# Altium project JacdacPowerUsbMicro2Port 137.PrjPCB
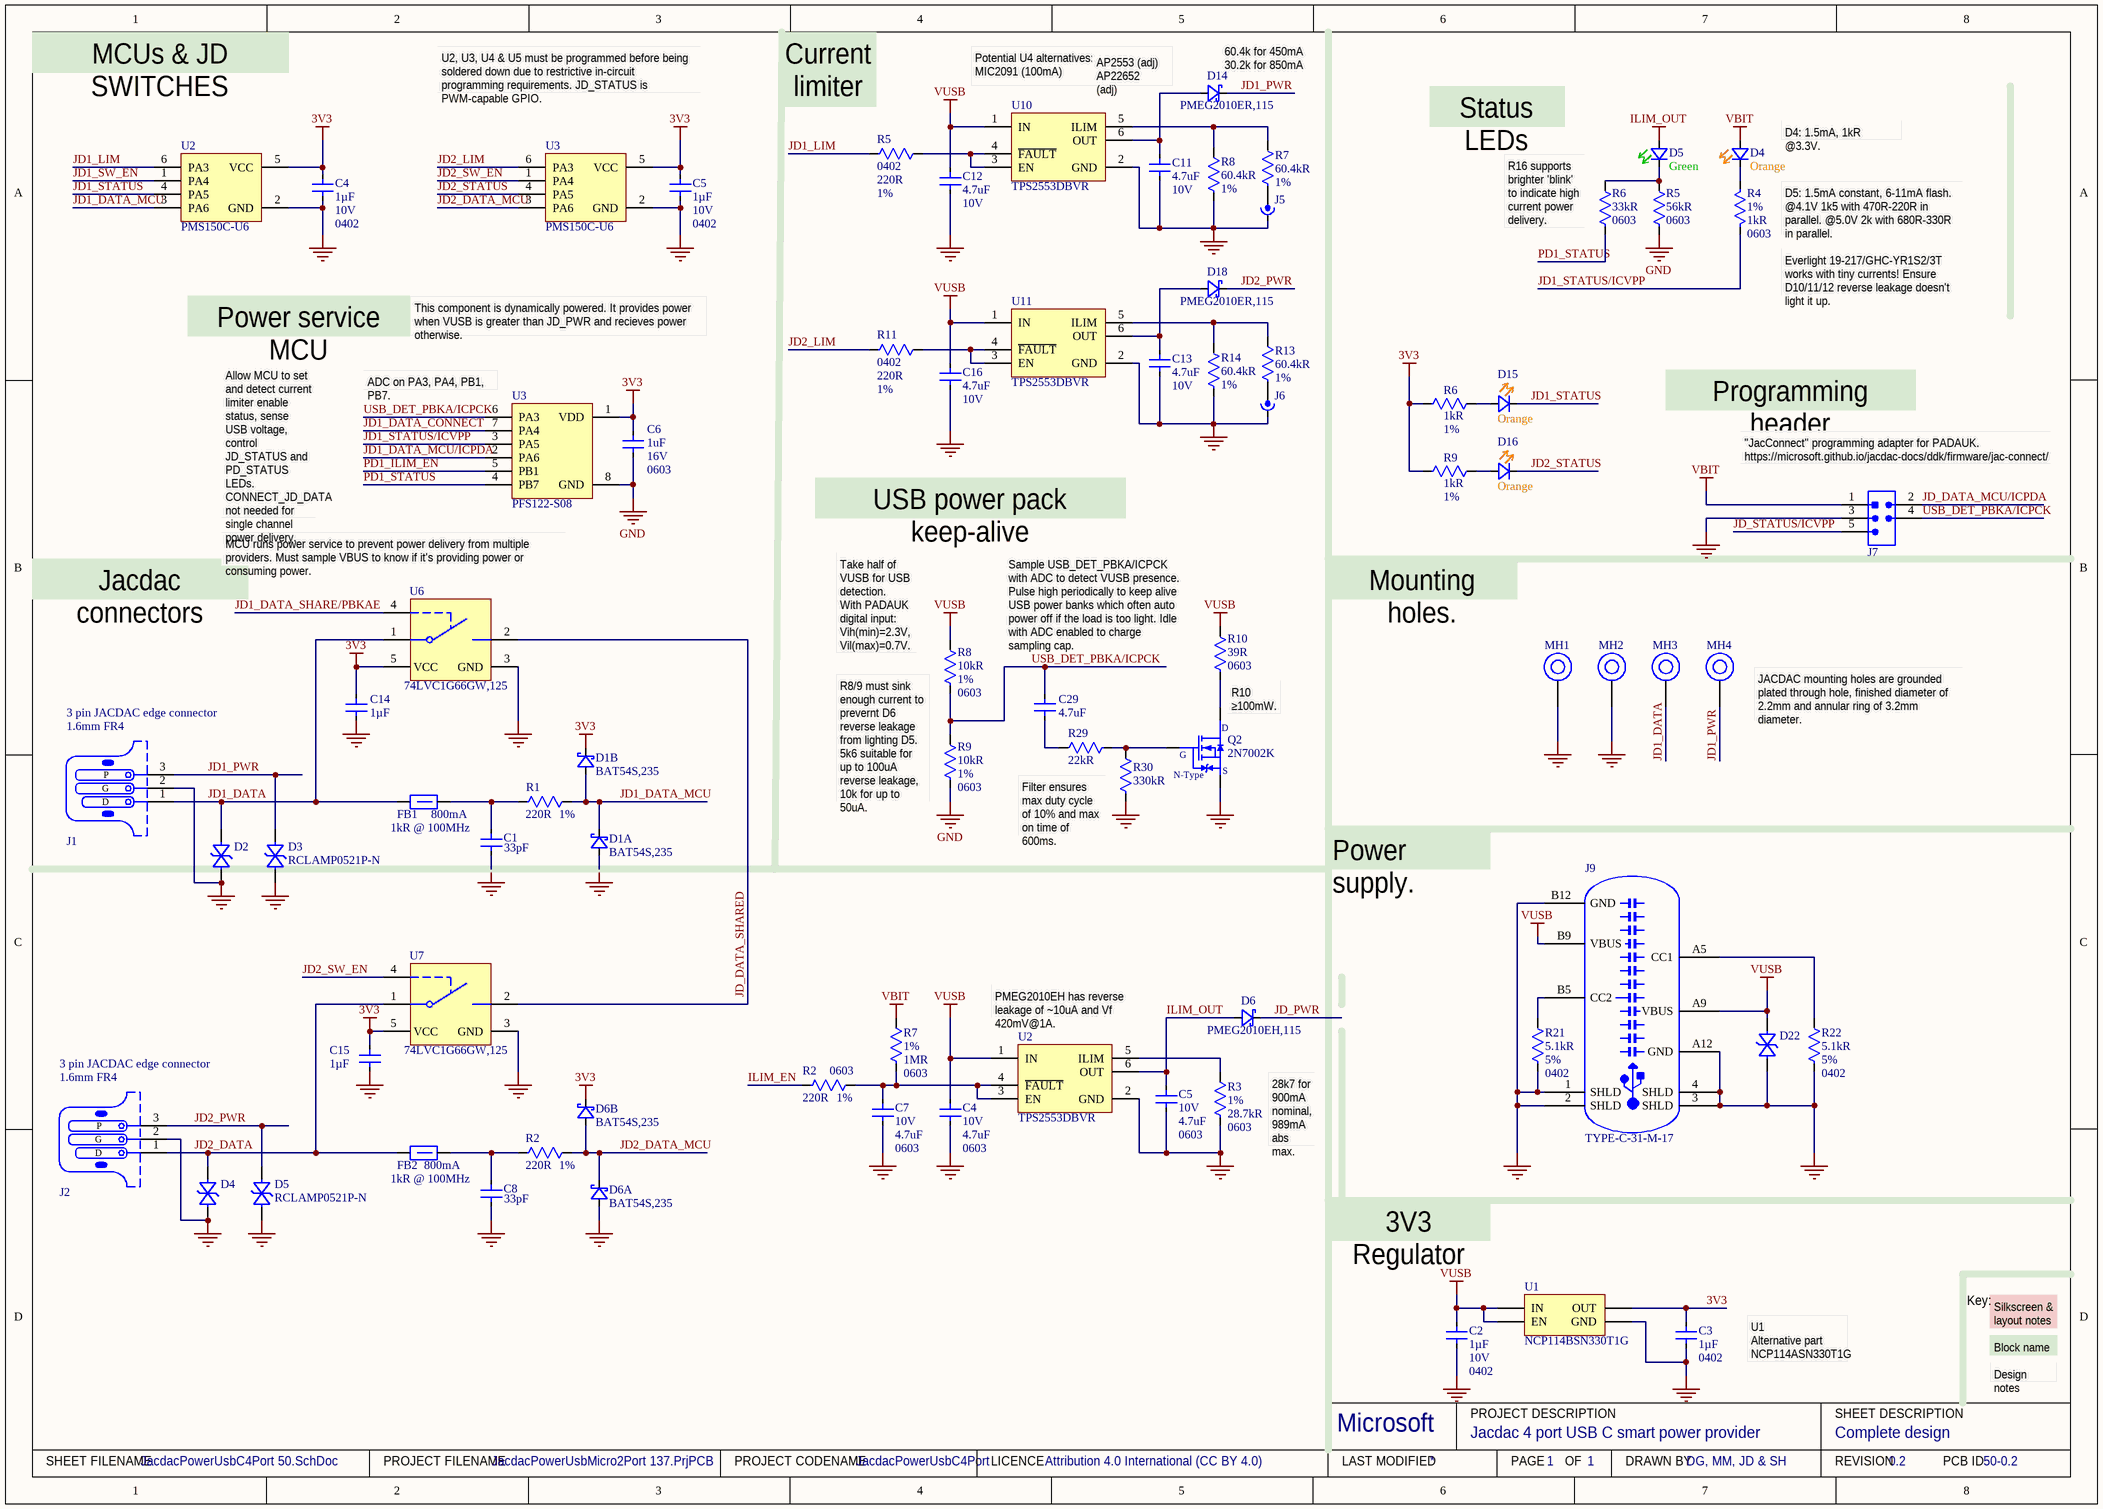
[diagram p0: JacdacPowerUsbC4Port 50.SchDoc]
ProjectCodeName: JacdacPowerUsbC4Port; ProjectCodenameDescription: Jacdac 4 port USB C smart power provider; ProjectCodenameID: 50; ProjectDrawnBy: DG, MM, JD & SH; ProjectLicenceTerms: Attribution 4.0 International (CC BY 4.0); ProjectRevision: 0.2
1 sheet, 76 parts. Net scope: global (net labels, ports and power ports of the same name join across sheets).
Board files: JacdacPowerUsbC4Port 50.PcbDoc, Panelized JacdacPowerUsbC4Port 50.PcbDoc

## Sheet JacdacPowerUsbC4Port 50.SchDoc: Complete design
size A3; DrawnBy: DG, MM, JD & SH; DocumentNumber: 1; Revision: 0.2; SheetNumber: 1; SheetTotal: 1; VersionControl_RevNumber: 1

### Parts
(Parts that share a designator on the sheet are numbered #1, #2 ... from top to bottom, then left to right.)
C1  Capacitance: 33pF  [C0402_0.55MM - without outline]  (hidden comment: CL05C330JB5NNNC)
C2  Capacitance: 1µF  Voltage Rating: 10V  Case Code (Imperial): 0402  [C0402_0.55MM - without outline]  (hidden comment: CL05A105KP5NNNC)
C3  Capacitance: 1µF  Case Code (Imperial): 0402  [C0402_0.55MM - without outline]  (hidden comment: CL05A105KP5NNNC)
C4#1  Capacitance: 1µF  Voltage Rating: 10V  Case Code (Imperial): 0402  [C0402_0.55MM - without outline]  (hidden comment: CL05A105KP5NNNC)
C4#2  Voltage Rating: 10V  Capacitance: 4.7uF  Case Code (Imperial): 0603  [C0603 - without outline]  (hidden comment: CL10A475KP8NNNC)
C5#1  Capacitance: 1µF  Voltage Rating: 10V  Case Code (Imperial): 0402  [C0402_0.55MM - without outline]  (hidden comment: CL05A105KP5NNNC)
C5#2  Voltage Rating: 10V  Capacitance: 4.7uF  Case Code (Imperial): 0603  [C0603 - without outline]  (hidden comment: CL10A475KP8NNNC)
C6  Voltage: 16V  Case/Package: 0603  Capacitance: 1uF  [C0603 - without outline]  (hidden comment: 1uF 16V)
C7  Voltage Rating: 10V  Capacitance: 4.7uF  Case Code (Imperial): 0603  [C0603 - without outline]  (hidden comment: CL10A475KP8NNNC)
C8  Capacitance: 33pF  [C0402_0.55MM - without outline]  (hidden comment: CL05C330JB5NNNC)
C11  Capacitance: 4.7uF  Voltage Rating: 10V  [R0402 - Without outline]  (hidden comment: CL05A475MP5NRNC)
C12  Capacitance: 4.7uF  Voltage Rating: 10V  [R0402 - Without outline]  (hidden comment: CL05A475MP5NRNC)
C13  Capacitance: 4.7uF  Voltage Rating: 10V  [R0402 - Without outline]  (hidden comment: CL05A475MP5NRNC)
C14  Capacitance: 1µF  [C0402_0.55MM - without outline]  (hidden comment: CL05A105KP5NNNC)
C15  Capacitance: 1µF  [C0402_0.55MM - without outline]  (hidden comment: CL05A105KP5NNNC)
C16  Capacitance: 4.7uF  Voltage Rating: 10V  [R0402 - Without outline]  (hidden comment: CL05A475MP5NRNC)
C29  Capacitance: 4.7uF  [C0402_0.55mm - without outline]  (hidden comment: CL05A475MP5NRNC)
D1  Manufacturer Part Number: BAT54S,235  [NXP-BAT54S-TO-236AB - without outline]  (hidden comment: BAT54S)  (parts A,B of 2)
D2  RCLAMP0521P-N  [TVS 0402 - without outline]  (value not drawn)
D3  RCLAMP0521P-N  [TVS 0402 - without outline]
D4#1  Colour: Orange  [0603 Orange]  (hidden comment: 19-217/S2C-AQ1R1B/3T)
D4#2  RCLAMP0521P-N  [TVS 0402 - without outline]  (value not drawn)
D5#1  Colour: Green  [0603 Green]
D5#2  RCLAMP0521P-N  [TVS 0402 - without outline]
D6#1  PMEG2010EH,115  [SOD-123W]
D6#2  Manufacturer Part Number: BAT54S,235  [NXP-BAT54S-TO-236AB - without outline]  (hidden comment: BAT54S)  (parts A,B of 2)
D14  PMEG2010ER,115  [SOD-123W]
D15  Colour: Orange  [0603 Orange]  (hidden comment: 19-217/S2C-AQ1R1B/3T)
D16  Colour: Orange  [0603 Orange]  (hidden comment: 19-217/S2C-AQ1R1B/3T)
D18  PMEG2010ER,115  [SOD-123W]
D22  RCLAMP0521P-N  [TVS 0402 - without outline]  (value not drawn)
FB1  Current Rating: 800mA  Impedance: 1kR @ 100MHz  [TDK MPZ1608 0.8mm - without outline]  (hidden comment: TDK MPZ1608S102ATA00)
FB2  Current Rating: 800mA  Impedance: 1kR @ 100MHz  [TDK MPZ1608 0.8mm - without outline]  (hidden comment: TDK MPZ1608S102ATA00)
J1  3 pin JACDAC edge connector  PCB Type: 1.6mm FR4  [JACDAC_EDGE_CONNECTOR_0.15mm_T&G]  (no BOM)
J2  3 pin JACDAC edge connector  PCB Type: 1.6mm FR4  [JACDAC_EDGE_CONNECTOR_0.15mm_T&G]  (no BOM)
J5  OpenSolderBlob  [SolderBlobA]  (value not drawn)  (no BOM)
J6  OpenSolderBlob  [SolderBlobA]  (value not drawn)  (no BOM)
J7  Hack Connect Mini 1.27 mm pitch 2-row  [HACK_CONNECT_MINI_5_X_1_27_0.559mm_TH]  (value not drawn)  (no BOM)
J9  TYPE-C-31-M-17  [TYPE-C-31-M-17]
MH1  MH_5.0MMK_3.0MMC_2.1MMD_PTH  [MH_5.0MMK_3.0MMC_2.1MMD_PTH]  (value not drawn)  (no BOM)
MH2  MH_5.0MMK_3.0MMC_2.1MMD_PTH  [MH_5.0MMK_3.0MMC_2.1MMD_PTH]  (value not drawn)  (no BOM)
MH3  MH_5.0MMK_3.0MMC_2.1MMD_PTH  [MH_5.0MMK_3.0MMC_2.1MMD_PTH]  (value not drawn)  (no BOM)
MH4  MH_5.0MMK_3.0MMC_2.1MMD_PTH  [MH_5.0MMK_3.0MMC_2.1MMD_PTH]  (value not drawn)  (no BOM)
Q2  2N7002K  [SOT23-ONS]
R1  Resistance: 220R  Tolerance: 1%  [R0402 - Without outline]  (hidden comment: RC0402FR-07220RL)
R2#1  Tolerance: 1%  Case/Package: 0603  [RC0603]  (hidden comment: 220R)
R2#2  Resistance: 220R  Tolerance: 1%  [R0402 - Without outline]  (hidden comment: RC0402FR-07220RL)
R3  Tolerance: 1%  Resistance: 28.7kR  Case/Package: 0603  [RC0603]  (hidden comment: 28.7k)
R4  Tolerance: 1%  Resistance: 1kR  Case/Package: 0603  [RC0603]  (hidden comment: 1k)
R5#1  Case Code (Imperial): 0402  Resistance: 220R  Tolerance: 1%  [R0402 - Without outline]  (hidden comment: RC0402FR-07220RL)
R5#2  value 56kR  Package Size: 0603  [CC0603]  (hidden comment: RES0603_GENERIC)
R6#1  value 33kR  Package Size: 0603  [CC0603]  (hidden comment: RES0603_GENERIC)
R6#2  Tolerance: 1%  Resistance: 1kR  [R0402 - Without outline]  (hidden comment: RC0402FR-071KL)
R7#1  Resistance: 60.4kR  Tolerance: 1%  [R0402 - Without outline]  (hidden comment: RC0402FR-0760K4L)
R7#2  Tolerance: 1%  Resistance: 1MR  Case/Package: 0603  [RC0603-M]  (hidden comment: 1M)
R8#1  Resistance: 60.4kR  Tolerance: 1%  [R0402 - Without outline]  (hidden comment: RC0402FR-0760K4L)
R8#2  value 10kR  Package Size: 0603  Tolerance: 1%  [CC0603]  (hidden comment: RES0603_GENERIC)
R9#1  Tolerance: 1%  Resistance: 1kR  [R0402 - Without outline]  (hidden comment: RC0402FR-071KL)
R9#2  value 10kR  Package Size: 0603  Tolerance: 1%  [CC0603]  (hidden comment: RES0603_GENERIC)
R10  Resistance: 39R  Case Code (Imperial): 0603  [RC0603-M]  (hidden comment: RC0603FR-0739RL)
R11  Case Code (Imperial): 0402  Resistance: 220R  Tolerance: 1%  [R0402 - Without outline]  (hidden comment: RC0402FR-07220RL)
R13  Resistance: 60.4kR  Tolerance: 1%  [R0402 - Without outline]  (hidden comment: RC0402FR-0760K4L)
R14  Resistance: 60.4kR  Tolerance: 1%  [R0402 - Without outline]  (hidden comment: RC0402FR-0760K4L)
R21  Resistance: 5.1kR  Tolerance: 5%  Case Code (Imperial): 0402  [R0402 - Without outline]  (hidden comment: RC0402JR-075K1L)
R22  Resistance: 5.1kR  Tolerance: 5%  Case Code (Imperial): 0402  [R0402 - Without outline]  (hidden comment: RC0402JR-075K1L)
R29  Resistance: 22kR  [R0402 - Without outline]  (hidden comment: RC0402FR-0722KL)
R30  Resistance: 330kR  [R0402 - without outline]  (hidden comment: RC0402FR-07330KL)
U1  LDO 3.3V/300 mA  [ON_SEMI-SOT23-5 - without outline]  (value not drawn)
U2#1  Manufacturer Part Number: PMS150C-U6  [SOT23-6]  (hidden comment: PMS150C)
U2#2  TPS2553DBVR  [TI-TPS2553 - without_outline]
U3#1  Manufacturer Part Number: PMS150C-U6  [SOT23-6]  (hidden comment: PMS150C)
U3#2  PFS122-S08  [SOP-8]
U6  74LVC1G66GW,125  [TSSOP-5/SOT353-1]
U7  74LVC1G66GW,125  [TSSOP-5/SOT353-1]
U10  TPS2553DBVR  [TI-TPS2553]
U11  TPS2553DBVR  [TI-TPS2553]

### Nets
3V3: C3.2 C4#1.2 C5#1.2 C6.2 C14.2 C15.2 D1.2(K) D6#2.2(K) R6#2.2 R9#1.2 U1.5(OUT) U2#1.5(VCC) U3#1.5(VCC) U3#2.1(VDD) U6.5(VCC) U7.5(VCC)
GND: C1.1 C2.1 C3.1 C4#1.1 C4#2.1 C5#1.1 C5#2.1 C6.1 C7.1 C8.1 C11.1 C12.1 C13.1 C14.1 C15.1 C16.1 D1.1(A) D2.2(A) D3.2(A) D4#2.2(A) D5#2.2(A) D6#2.1(A) D22.2(A) J1.2(G) J2.2(G) J5.2 J6.2 J7.3(GND) J9.1(SHLD) J9.2(SHLD) J9.3(SHLD) J9.4(SHLD) J9.A12(GND) J9.B12(GND) MH1.1 MH2.1 Q2.2(S) R3.1 R5#2.2 R8#1.1 R9#2.2 R14.1 R21.2 R22.2 R30.2 U1.2(GND) U2#1.2(GND) U2#2.2(GND) U3#1.2(GND) U3#2.8(GND) U6.3(GND) U7.3(GND) U10.2(GND) U11.2(GND)
ILIM_OUT: C5#2.2 D5#1.2(A) D6#1.2(A) U2#2.6(OUT)
VBIT: D4#1.2(A) J7.1(VCC) R7#2.2
VUSB: C2.2 C4#2.2 C12.2 C16.2 D22.1(K) J9.A9(VBUS) J9.B9(VBUS) R8#2.1 R10.2 U1.1(IN) U1.3(EN) U2#2.1(IN) U10.1(IN) U11.1(IN)
ILIM_EN: R2#1.1
JD1_DATA: D2.1(K) FB1.1 J1.1(D) MH3.1 U6.1(Y)
JD1_DATA_CONNECT: U3#2.7(PA4)
JD1_DATA_MCU: D1.3(K) R1.1 U2#1.3(PA6)
JD1_DATA_MCU/ICPDA: U3#2.2(PA6)
JD1_DATA_SHARE/PBKAE: U6.4(EN)
JD1_LIM: R5#1.2 U2#1.6(PA3)
JD1_PWR: D3.1(K) D14.1(K) J1.3(P) MH4.1
JD1_STATUS: D15.1(K) U2#1.4(PA5)
JD1_STATUS/ICVPP: R4.2 U3#2.3(PA5)
JD1_SW_EN: U2#1.1(PA4)
JD2_DATA: D4#2.1(K) FB2.1 J2.1(D) U7.1(Y)
JD2_DATA_MCU: D6#2.3(K) R2#2.1 U3#1.3(PA6)
JD2_LIM: R11.2 U3#1.6(PA3)
JD2_PWR: D5#2.1(K) D18.1(K) J2.3(P)
JD2_STATUS: D16.1(K) U3#1.4(PA5)
JD2_SW_EN: U3#1.1(PA4) U7.4(EN)
JD_DATA_MCU/ICPDA: J7.2(SWDIO)
JD_DATA_SHARED: U6.2(Z) U7.2(Z)
JD_PWR: D6#1.1(K)
JD_STATUS/ICVPP: J7.5(RESET)
PD1_ILIM_EN: U3#2.5(PB1)
PD1_STATUS: R6#1.2 U3#2.4(PB7)
USB_DET_PBKA/ICPCK: C29.1 J7.4(SWCLK) R8#2.2 R9#2.1 U3#2.6(PA3)
NetC1_2: C1.2 FB1.2 R1.2
NetC7_2: C7.2 R2#1.2 R7#2.1 U2#2.3(EN) U2#2.4(~{FAULT})
NetC8_2: C8.2 FB2.2 R2#2.2
NetC11_2: C11.2 D14.2(A) U10.6(OUT)
NetC13_2: C13.2 D18.2(A) U11.6(OUT)
NetC29_2: C29.2 R29.2
NetD4#1_1: D4#1.1(K) R4.1
NetD5#1_1: D5#1.1(K) R5#2.1 R6#1.1
NetD15_2: D15.2(A) R6#2.1
NetD16_2: D16.2(A) R9#1.1
NetJ5_1: J5.1 R7#1.1
NetJ6_1: J6.1 R13.1
NetJ9_A5: J9.A5(CC1) R22.1
NetJ9_B5: J9.B5(CC2) R21.1
NetQ2_1: Q2.1(G) R29.1 R30.1
NetQ2_3: Q2.3(D) R10.1
NetR3_2: R3.2 U2#2.5(ILIM)
NetR5#1_1: R5#1.1 U10.3(EN) U10.4(~{FAULT})
NetR7#1_2: R7#1.2 R8#1.2 U10.5(ILIM)
NetR11_1: R11.1 U11.3(EN) U11.4(~{FAULT})
NetR13_2: R13.2 R14.2 U11.5(ILIM)

### Notes on the sheet
- MCUs & JD SWITCHES
- U2, U3, U4 & U5 must be programmed before being soldered down due to restrictive in-circuit programming requirements. JD_STATUS is PWM-capable GPIO.
- (near R5#1) Current limiter
- Potential U4 alternatives:
  MIC2091 (100mA)
- AP2553 (adj)
  AP22652 (adj)
- (near D14) 60.4k for 450mA
  30.2k for 850mA
- Status LEDs
- D4: 1.5mA, 1kR @3.3V.
- (near R6#1) R16 supports brighter 'blink' to indicate high current power delivery.
- D5: 1.5mA constant, 6-11mA flash. @4.1V 1k5 with 470R-220R in parallel. @5.0V 2k with 680R-330R in parallel.
- (near R4) Everlight 19-217/GHC-YR1S2/3T works with tiny currents! Ensure D10/11/12 reverse leakage doesn't light it up.
- Power service MCU
- This component is dynamically powered. It provides power when VUSB is greater than JD_PWR and recieves power otherwise.
- (near U3#2) ADC on PA3, PA4, PB1, PB7.
- Programming header
- Allow MCU to set and detect current limiter enable status, sense USB voltage, control JD_STATUS and PD_STATUS LEDs. CONNECT_JD_DATA not needed for single channel power delivery.
- USB power pack keep-alive
- (near J7) "JacConnect" programming adapter for PADAUK.
  https://microsoft.github.io/jacdac-docs/ddk/firmware/jac-connect/
- MCU runs power service to prevent power delivery from multiple providers. Must sample VBUS to know if it's providing power or consuming power.
- Jacdac connectors
- (near R8#2) Take half of VUSB for USB detection.
  With PADAUK digital input: Vih(min)=2.3V, Vil(max)=0.7V.
- (near R10) Sample USB_DET_PBKA/ICPCK with ADC to detect VUSB presence. Pulse high periodically to keep alive USB power banks which often auto power off if the load is too light. Idle with ADC enabled to charge sampling cap.
- Mounting holes.
- R10 ≥100mW.
- (near MH4) JACDAC mounting holes are grounded plated through hole, finished diameter of 2.2mm and annular ring of 3.2mm diameter.
- R8/9 must sink enough current to prevernt D6 reverse leakage from lighting D5. 5k6 suitable for up to 100uA reverse leakage, 10k for up to 50uA.
- Filter ensures max duty cycle of 10% and max on time of 600ms.
- Power supply.
- (near U2#2) PMEG2010EH has reverse leakage of ~10uA and Vf 420mV@1A.
- 28k7 for 900mA nominal,
  989mA abs max.
- 3V3 Regulator
- Key:
- Silkscreen & layout notes
- U1
  Alternative part
  NCP114ASN330T1G
- Block name
- Design notes
- Microsoft
- PROJECT DESCRIPTION
- SHEET DESCRIPTION
- SHEET FILENAME
- PROJECT FILENAME
- PROJECT CODENAME
- LICENCE
- LAST MODIFIED
- PAGE
- OF
- DRAWN BY
- REVISION
- PCB ID
- (in symbol 2N7002K) N-Type

### Library data of the parts
C1 C8 = CL05C330JB5NNNC: CAP CER 33PF 50V C0G/NP0 0402; Manufacturer: Samsung; Material: Ceramic; Tolerance: 5%; Dielectric: C0G; Temperature Coefficient: 300ppm/°C; Supplier 1: Digi-Key; Manufacturer Part Number: CL05C330JB5NNNC; RoHS: Yes; Category: Ceramic Capacitors; Stock 1: 5436088; Pricing 1: 1=0.10000, 10=0.02300, 50=0.01260, 100=0.01040, 500=0.00740, 1000=0.00582, 2500=0.00529, 5000=0.00487 (USD); Mount: Surface Mount; Case Code (Metric): 1005; Case Code (Imperial): 0402; Contact Plating: Tin; Min Operating Temperature: -55°C; Max Operating Temperature: 125°C; Package Quantity: 1; Packaging: Tape and Reel; Voltage: 50V; Voltage Rating (DC): 50V; Series: CL; Construction: Flat; Length: 1mm; Width: 0.02inch; Height: 0.5mm; Thickness: 0.022inch; Depth: 0.5mm; Radiation Hardening: No; Lead Free: Lead Free; RoHS Compliant: Yes; ComponentLink1URL: https://datasheet.ciiva.com/15195/getdatasheetpartid-355282-15195687.pdf; ComponentLink1Description: Online datasheet; Supplier 2: Newark; Stock 2: 45340; Pricing 2: 1=0.12500, 25=0.02900, 100=0.01300, 250=0.01100, 500=0.00900, 1000=0.00600 (USD); Supplier 3: Mouser; Stock 3: 8877; Pricing 3: 1=0.10000, 10=0.01400, 50=0.01400, 100=0.01100, 1000=0.00600, 10000=0.00400 (USD); Supplier 4: Farnell; Stock 4: 10934; Pricing 4: 150=0.01120, 500=0.00860, 2500=0.00640, 5000=0.00550 (GBP); Supplier Part Number 4: 3013373RL; Supplier Part Number 3: 187-CL05C330JB5NNNC; Supplier Part Number 2: 82AC9259; Supplier Part Number 1: 1276-1272-1-ND; Voltage Rating: 50V; Case/Package: 0402
C2 C3 C4#1 C5#1 C14 C15 = CL05A105KP5NNNC: CAP CER 1UF 10V X5R 0402; Manufacturer: Samsung; Material: Ceramic; Tolerance: 10%; Supplier 1: Digi-Key; Manufacturer Part Number: CL05A105KP5NNNC; RoHS: Yes; Category: Capacitors; Stock 1: 5705569; Pricing 1: 1=0.10000, 10=0.03900, 50=0.02100, 100=0.01720, 500=0.01228, 1000=0.00965, 2500=0.00877, 5000=0.00807 (USD); Mount: Surface Mount; Case/Package: 0402; Case Code (Metric): 1005; Contact Plating: Tin; Min Operating Temperature: -55°C; Max Operating Temperature: 85°C; Dielectric: X5R; Package Quantity: 1; Packaging: Tape and Reel; Length: 1mm; Height: 0.5mm; Width: 0.02inch; Thickness: 0.022inch; Depth: 0.5mm; Radiation Hardening: No; ComponentLink1URL: https://datasheet.ciiva.com/15195/getdatasheetpartid-358390-15195630.pdf; ComponentLink1Description: Online datasheet; Supplier 2: Mouser; Stock 2: 928941; Pricing 2: 1=0.10000, 10=0.04200, 100=0.01800, 500=0.01300, 1000=0.01000, 2500=0.00900 (USD); Supplier 3: Farnell; Stock 3: 53670; Pricing 3: 10=0.02450, 100=0.02000, 500=0.01310, 2500=0.00920, 5000=0.00810, 10000=0.00640, 50000=0.00490 (GBP); Supplier Part Number 3: 3013329; Supplier Part Number 2: 187-CL05A105KP5NNNC; Supplier Part Number 1: 1276-1076-1-ND; Created: DG; Checked: ?
  C3: Voltage Rating: 10V
  C14 C15: Voltage Rating: 10V; Case Code (Imperial): 0402
C4#2 C5#2 C7 = CL10A475KP8NNNC: CAP CER 4.7UF 10V X5R 0603; Manufacturer: Samsung; Tolerance: 10%; Supplier 1: Farnell; Manufacturer Part Number: CL10A475KP8NNNC; RoHS: Yes; Category: Ceramic Capacitors; Stock 1: 75690; Pricing 1: 10=0.02700, 100=0.02160, 500=0.01580, 1000=0.01310, 2000=0.01130 (GBP); Mount: Surface Mount; Case/Package: 0603; Case Code (Metric): 1608; Contact Plating: Tin; Min Operating Temperature: -55°C; Max Operating Temperature: 85°C; Dielectric: X5R; Package Quantity: 1; Packaging: Tape and Reel; Series: CL; Construction: Flat; Length: 1.6mm; Width: 0.031inch; Height: 0.8mm; Thickness: 0.035inch; Depth: 0.8mm; Radiation Hardening: No; RoHS Compliant: Yes; ComponentLink1URL: https://datasheet.ciiva.com/25797/cl10a475kp8nnnc-25797520.pdf; ComponentLink1Description: Online datasheet; Supplier 2: Digi-Key; Pricing 2: 1=0.10000, 10=0.04900, 50=0.02680, 100=0.02180, 500=0.01558, 1000=0.01224 (USD); Supplier Part Number 2: 1276-1044-1-ND; Supplier Part Number 1: 3013398; Created By: D Gakure; Checked By: ?
C6 = CL10A105KO8NNNC: SMD Multilayer Ceramic Capacitor, 1 µF, 16 V, 0603 [1608 Metric], ± 10%, X5R, CL Series; Manufacturer: Samsung; ComponentLink1URL: https://datasheet.lcsc.com/lcsc/1811021622_Samsung-Electro-Mechanics-CL10A105KO8NNNC_C1592.pdfq; ComponentLink1Description: Online datasheet; Supplier 1: Digi-Key; Manufacturer Part Number: CL10A105KO8NNNC; RoHS: Yes; Category: Ceramic Capacitors; Stock 1: 3575337; Pricing 1: 1=0.10000, 10=0.03600, 50=0.01960, 100=0.01600, 500=0.01144, 1000=0.00898 (USD); Mount: Surface Mount; Case Code (Metric): 1608; Case Code (Imperial): 0603; Material: Ceramic; Contact Plating: Tin; Min Operating Temperature: -55°C; Max Operating Temperature: 85°C; Tolerance: 10%; Package Quantity: 1; Packaging: Tape and Reel; Voltage Rating: 16V; Dielectric: X5R; Voltage Rating (DC): 16V; Series: CL; Construction: Flat; Length: 1.6mm; Width: 0.031inch; Height: 0.8mm; Thickness: 0.035inch; Depth: 0.8mm; Radiation Hardening: No; Lead Free: Lead Free; RoHS Compliant: Yes; Supplier 2: Farnell; Supplier 3: RSComponents; Supplier 4: Mouser; Supplier Part Number 1: 1276-1034-1-ND; Supplier Part Number 2: 3013384; Supplier Part Number 3: 7664780; Supplier Part Number 4: 187-CL10A105KO8NNNC; Supplier 5: LCSC; Supplier Part Number 5: C1592; Manufacturer 1: Samsung; Manufacturer Part Number 1: CL10A105KO8NNNC
C11-C13 C16 C29 = CL05A475MP5NRNC: CAP CER 4.7UF 10V X5R 0402; Manufacturer: Samsung; Tolerance: 20%; Supplier 1: Digi-Key; Manufacturer Part Number: CL05A475MP5NRNC; RoHS: Yes; Category: Ceramic Capacitors; Stock 1: 840000; Pricing 1: 10000=0.01405, 20000=0.01338 (USD); Mount: Surface Mount; Case/Package: 0402; Case Code (Metric): 1005; Min Operating Temperature: -55°C; Max Operating Temperature: 85°C; Package Quantity: 10000; Packaging: Tape and Reel; Dielectric: X5R; Series: CL; Length: 0.039inch; Width: 0.02inch; Thickness: 0.022inch; Lead Free: Lead Free; RoHS Compliant: Yes; ComponentLink1URL: https://datasheet.ciiva.com/25786/cl05a475mp5nrnc-25786963.pdf; ComponentLink1Description: Online datasheet; Supplier 2: Future Electronics; Stock 2: 2004; Pricing 2: 1=0.23500, 500=0.03970, 1500=0.02900, 2500=0.02500, 5000=0.02050 (USD); Created By: D. Gakure; Checked By: ?; Supplier Part Number 2: 2103694; Supplier Part Number 1: 1276-1482-2-ND; Case Code (Imperial): 0402
  C29: Voltage Rating: 10V
D1 D6#2 = BAT54S: DIODE ARRAY SCHOTTKY 30V SOT23; Manufacturer: Nexperia; Supplier 1: Digi-Key; RoHS: No; Category: Rectifier Diodes; Stock 1: 14011; Pricing 1: 1=0.13000, 10=0.11900, 100=0.05610, 500=0.03326, 1000=0.02185, 5000=0.02138 (USD); ComponentLink1URL: https://assets.nexperia.com/documents/data-sheet/BAT54_SER.pdf; ComponentLink1Description: NXP datasheet online; Supplier 2: Mouser; Supplier 3: RSComponents; Supplier Part Number 2: 771-BAT54S235; Supplier Part Number 3: 1707990; Supplier Part Number 1: 1727-1868-1-ND
D2 D3 D4#2 D5#2 D22 = RCLAMP0521P-N: Bidirectional 5V (Max) 6V 16V 3.5A (8/20us) 0402 TVS RoHS; Manufacturer: Born Semiconductor; Package: 0402; Created By: D Gakure; Checked By: ?; Supplier1: LCSC; Supplier1 Part Number: C316043; ComponentLink1Description: Online datasheet; ComponentLink1URL: https://datasheet.lcsc.com/szlcsc/Bourne-Semicon-Shenzhen-RCLAMP0521P-N_C316043.pdf; Manufacturer Part Number: RCLAMP0521P-N
D4#1 D15 D16 = 19-217/S2C-AQ1R1B/3T: LED ORANGE DIFFUSED 0603 SMD; Manufacturer: Everlight Elec; Manufacturer Part Number: 19-217/S2C-AQ1R1B/3T; Mount: Surface Mount; Case/Package: 0603; Color: Orange; Case Code (Imperial): 0603; ComponentLink1URL: https://datasheet.lcsc.com/lcsc/1912171731_Everlight-Elec-19-217-S2C-AQ1R1B-3T_C146215.pdf; ComponentLink1Description: Online datasheet; Supplier 1: LCSC; Supplier 1 Part Number: C146215
D5#1 = 19-217/GHC-YR1S2/3T: LED GREEN DIFFUSED 0603 SMD; Manufacturer 1: Everlight Elec; Manufacturer Part Number 1: 19-217/GHC-YR1S2/3T; Mount: Surface Mount; Case/Package: 0603; Color: Green; Case Code (Imperial): 0603; ComponentLink1URL: https://datasheet.lcsc.com/lcsc/1811101510_Everlight-Elec-19-217-GHC-YR1S2-3T_C72043.pdf; ComponentLink1Description: Online datasheet; Supplier 1: LCSC; Supplier 1 Part Number: C72043
D6#1 = PMEG2010EH,115: NEXPERIA - PMEG2010EH,115 - DIODE, RECT SCH, 20V, 1A, SOD123f; Manufacturer: Nexperia; RoHS: Yes; RoHS Compliant: Yes; ComponentLink1URL: https://datasheet.lcsc.com/lcsc/2006101640_Nexperia-PMEG2010EH-115_C552825.pdf; ComponentLink1Description: Online datasheet; Manufacturer Part Number: PMEG2010EH,115
D14 D18 = PMEG2010ER,115: NEXPERIA - PMEG2010ER,115 - DIODE, RECT SCH, 20V, 1A, SOD123W; Supplier 1: Digi-Key; Manufacturer: Nexperia; RoHS: Yes; Stock 1: 722; Pricing 1: 1=0.42000, 10=0.31300, 100=0.19480, 500=0.13328, 1000=0.10252 (USD); RoHS Compliant: Yes; ComponentLink1URL: http://www.farnell.com/datasheets/1383341.pdf; ComponentLink1Description: Online datasheet; Supplier 2: Future Electronics; Stock 2: 144000; Pricing 2: 3000=0.20000, 6000=0.16300, 9000=0.16200, 12000=0.16100, 15000=0.16000 (USD); Supplier 3: RSComponents; Stock 3: 1; Pricing 3: 50=0.32100, 100=0.26700, 250=0.21200, 500=0.11100, 1000=0.08200 (USD); Supplier 4: Mouser; Stock 4: 2146; Pricing 4: 1=0.37000, 10=0.25700, 50=0.25700, 100=0.13400, 1000=0.09400, 10000=0.07200 (USD); Supplier 5: Farnell; Stock 5: 24250; Pricing 5: 5=0.40400, 10=0.27600, 100=0.13400, 500=0.11500, 1000=0.07750 (GBP); Supplier Part Number 5: 1907681; Supplier Part Number 4: 771-PMEG2010ER115; Supplier Part Number 3: 8166824P; Supplier Part Number 2: 4222907; Supplier Part Number 1: 1727-5192-1-ND; Manufacturer Part Number: PMEG2010ER,115
FB1 FB2 = TDK MPZ1608S102ATA00: 0603 1k@100MHz 0.8A chip; Core Material: Ferrite; Tolerance: 25%; DC Resistance (DCR): 300mR; Supplier 1: Digi-Key; Stock 1: 113542; Pricing 1: 1=0.1, 10=0.079, 25=0.0716, 50=0.0644, 100=0.0472, 250=0.03432, 500=0.03146, 1000=0.02717 (USD); Mount: Surface Mount; Case/Package: 0603; Case Code (Metric): 1608; Case Code (Imperial): 0603; Package Quantity: 4000; Packaging: Tape and Reel; Max DC Current: 800mA; Length: 0.063inch; Height: 0.037inch; Width: 0.031inch; ComponentLink2URL: https://www.mouser.co.uk/datasheet/2/400/eads_commercial_power_mpz1608_en-923650.pdf; ComponentLink2Description: datasheet online; Supplier 2: Mouser; ComponentLink3Description: datasheet; ComponentLink3URL: Y:\System\Altium\Libraries 2014\TDK\Datasheets\eads_commercial_power_mpz1608_en-923650.pdf; Supplier Part Number 1: 445-8694-1-ND; Supplier Part Number 2: 810-MPZ1608S102ATA00; Manufacturer: TDK; Manufacturer Part Number: MPZ1608S102ATA00
J1 J2 = Jacdac edge connector: 3 pin Jacdac edge connector 1.27mm pitch; Manufacturer Part Number: JACDAC_EDGE_CONNECTOR; Checked By: ?; Created By: D. Gakure; ComponentLink1Description: Yuliang JACDAC cable connector drawing online; ComponentLink1URL: https://github.com/microsoft/jacdac-mdk/blob/main/connector/JACDAC-Connector-by-Yuliang-2020-11-28.pdf; ComponentLink2Description: JACDAC PCB edge connector spec onlin; ComponentLink2URL: https://github.com/microsoft/jacdac-mdk/blob/main/connector/JACDAC_PCB_Edge_Connector_Drawing_JD-PEC-01_rev_01.pdf
J5 J6 = OpenSolderBlob: Open solder blob
J7 = HACK_CONNECT_MINI
J9 = TYPE-C-31-M-17: USB - Type C Female 6 USB Connectors RoHS; Manufacturer: Korean Hroparts Elec; Gender: Receptacle; Number of Positions: 6; RoHS: Yes; Category: USB Connectors; Orientation: Right Angle; ComponentLink1URL: https://datasheet.lcsc.com/szlcsc/1811101526_Korean-Hroparts-Elec-TYPE-C-31-M-17_C283540.pdf; ComponentLink1Description: Online datasheet; Supplier 1 Part Number: C283540; Supplier 1: LCSC; Manufacturer Part Number: TYPE-C-31-M-17
MH1-MH4 = MH_5.0MMK_3.0MMC_2.1MMD_PTH: Mounting Hole 5.0mm keepout, 3.0mm annualar ring and 2.1mm Drill PTH
Q2 = 2N7002K: MOSFET Transistor, N Channel, 300 mA, 60 V, 2 ohm, 10 V, 2.5 V; Manufacturer: ON Semiconductor / Fairchild; Max Power Dissipation: 350mW; Continuous Drain Current (ID): 300mA; Input Capacitance: 50pF; Number of Elements: 1; Rds On Max: 2R; Drain to Source Breakdown Voltage: 60V; Threshold Voltage: 2.5V; Element Configuration: Single; Gate to Source Voltage (Vgs): 20V; Turn-Off Delay Time: 30ns; Turn-On Delay Time: 5ns; Polarity: N-CHANNEL; Supplier 1: Digi-Key; Stock 1: 53564; Pricing 1: 1=0.40000, 10=0.32500, 25=0.27240, 100=0.17240, 500=0.11344, 1000=0.07714 (USD); Case/Package: SOT-23; Number of Pins: 3; Contact Plating: Tin,Matte; Min Operating Temperature: -55°C; Max Operating Temperature: 150°C; Packaging: Tape and Reel; Power Dissipation: 350mW; Package Quantity: 1; Drain to Source Resistance: 2R; On-State Resistance: 2R; Length: 2.92mm; Height: 1.2mm; Width: 1.3mm; Radiation Hardening: No; Lead Free: Lead Free; REACH SVHC: No SVHC; Supplier 2: Mouser; ComponentLink1Description: Online datasheet; ComponentLink1URL: https://www.onsemi.com/pdf/datasheet/2n7002k-d.pdf; Supplier Part Number 2: 512-2N7002K; Supplier Part Number 1: 2N7002KCT-ND; Manufacturer Part Number: 2N7002K; Supplier 3: Farnell; Supplier Part Number 3: 2453382; Category: MOSFETs; Checked By: ?; Created By: D. Gakure; Drain-source On Resistance-Max: 2R; Drain to Source Voltage (Vdss): 60V; Mount: Surface Mount; Pricing 2: 1=0.40000, 10=0.27300, 50=0.27300, 100=0.13400, 1000=0.07800, 10000=0.05100 (USD); Pricing 3: 5=0.34800, 10=0.23500, 100=0.09100, 500=0.05850, 3000=0.04630, 9000=0.03860, 24000=0.03750, 45000=0.03530 (GBP); RoHS: Yes; Stock 2: 111825; Stock 3: 101059; Voltage: 60V
R1 R2#2 R5#1 R11 = RC0402FR-07220RL: RES SMD 220 OHM 1% 1/16W 0402; Manufacturer: Yageo; Power Rating: 62.5mW; Voltage Rating: 50V; Temperature Coefficient: 100ppm/°C; Max Power Dissipation: 63mW; Supplier 1: Digi-Key; Manufacturer Part Number: RC0402FR-07220RL; RoHS: Yes; Category: Resistors; Stock 1: 1286042; Pricing 1: 1=0.10000, 10=0.01400, 100=0.00580, 1000=0.00262, 2500=0.00228, 5000=0.00188 (USD); Case/Package: 0402; Number of Pins: 2; Case Code (Metric): 1005; Min Operating Temperature: -55°C; Max Operating Temperature: 155°C; Packaging: Tape and Reel; Voltage Rating (DC): 50V; Package Quantity: 1; Termination: SMD/SMT; Resistor Type: Thick Film; Number of Terminations: 2; Features: Moisture Resistant; Length: 1mm; Height: 0.016inch; Width: 0.02inch; Depth: 0.5mm; REACH SVHC: No SVHC; Military Standard: Not; Lead Free: Lead Free; ComponentLink1URL: https://datasheet.ciiva.com/11819/0900766b80c66297-11819466.pdf; ComponentLink1Description: Online datasheet; Supplier 2: Mouser; Stock 2: 324625; Pricing 2: 1=0.10000, 10=0.01200, 100=0.00400, 1000=0.00400, 2500=0.00400, 10000=0.00300 (USD); Supplier 3: Farnell; Stock 3: 18234; Pricing 3: 1=0.08130, 25=0.01210, 100=0.01120, 250=0.01030, 500=0.00900 (GBP); Supplier Part Number 3: 2147864; Supplier Part Number 2: 603-RC0402FR-07220RL; Supplier Part Number 1: 311-220LRCT-ND; Created: D.G; Checked: ?
  R1 R2#2: Case Code (Imperial): 0402
R2#1 = RC0603FR-07220RL: Res Thick Film 0603 220 Ohm 1% 0.1W(1/10W) ±100ppm/°C Pad SMD T/R; Manufacturer 1: Yageo; Voltage Rating (DC): 50V; Power Rating: 100mW; ComponentLink4URL: https://datasheet.ciiva.com/46395/443971-46395002.pdf; ComponentLink4Description: online datasheet; Supplier 1: Digi-Key; Manufacturer Part Number 1: RC0603FR-07220RL; RoHS: Yes; Category: Chip SMD Resistors; Stock 1: 1257522; Pricing 1: 1=0.10000, 10=0.02300, 100=0.00930, 1000=0.00417, 2500=0.00362 (USD); Number of Pins: 2; Case Code (Imperial): 0603; Case Code (Metric): 1608; Size Code: 0603; Min Operating Temperature: -55°C; Max Operating Temperature: 155°C; Resistor Type: Thick Film; Temperature Coefficient: 100ppm/°C; Packaging: Tape and Reel; Voltage Rating: 50V; Package Quantity: 1; Termination: SMD/SMT; Number of Terminations: 2; Max Power Dissipation: 100mW; Features: Moisture Resistant; Series: RC; Resistance Tolerance: 1%; Construction: Rectangular; Length: 1.6mm; Width: 0.031inch; Height: 0.022inch; Depth: 0.8mm; REACH SVHC: No SVHC; Lead Free: Lead Free; RoHS Compliant: Yes; Military Standard: Not; Supplier 2: Farnell; Supplier 3: Mouser; Supplier 4: RSComponents; Supplier Part Number 2: 2421863; Supplier Part Number 3: 603-RC0603FR-07220RL; Supplier Part Number 4: 1995497; Supplier Part Number 1: 311-220HRCT-ND; Manufacturer: Yageo; Manufacturer Part Number: RC0603FR-07220RL; Resistance: 220R
R3 = RC0603FR-0728K7L: Res Thick Film 0603 28.7k Ohm 1% 0.1W(1/10W) ±100ppm/C Pad SMD T/R; Manufacturer 1: Yageo; Voltage Rating: 50V; Power Rating: 100mW; Temperature Coefficient: 100ppm/°C; Supplier 1: Digi-Key; Manufacturer Part Number 1: RC0603FR-0728K7L; RoHS: Yes; Category: Chip SMD Resistors; Stock 1: 276730; Pricing 1: 1=0.10000, 10=0.02300, 100=0.00930, 1000=0.00417, 2500=0.00362 (USD); Mount: Surface Mount; Case Code (Imperial): 0603; Case Code (Metric): 1608; Size Code: 0603; Min Operating Temperature: -55°C; Max Operating Temperature: 155°C; Packaging: Tape and Reel; Package Quantity: 1; Resistor Type: Thick Film; Termination: SMD/SMT; Number of Terminations: 2; Max Power Dissipation: 100mW; Voltage Rating (DC): 50V; Features: Moisture Resistant; Series: RC; Construction: Rectangular; Technology: THICK FILM; Length: 1.6mm; Width: 0.031inch; Height: 0.022inch; Depth: 0.8mm; Military Standard: Not; Lead Free: Lead Free; RoHS Compliant: Yes; ComponentLink5URL: https://datasheet.ciiva.com/2553/pyu-r-int-thick-7-2553533.pdf; ComponentLink5Description: onilne datasheet; Manufacturer: Yageo; Manufacturer Part Number: RC0603FR-0728K7L; Supplier 2: Farnell; Supplier 3: Mouser; Supplier 4: RSComponents; Supplier Part Number 1: 311-28.7KHRCT-ND; Supplier Part Number 2: 3951071; Supplier Part Number 3: 603-RC0603FR-0728K7L; Supplier Part Number 4: 505-1003
R4 = RC0603FR-071KL: Res Thick Film 0603 1K Ohm 1% 1/10W ±100ppm/°C Molded SMD SMD Paper T/R; Manufacturer: Yageo; Power Rating: 100mW; Voltage Rating: 50V; ComponentLink4URL: https://datasheet.ciiva.com/46395/443971-46395002.pdf; ComponentLink4Description: online datasheet; Manufacturer Part Number: RC0603FR-071KL; Supplier 1: Digi-Key; Manufacturer 1: Yageo; Manufacturer Part Number 1: RC0603FR-071KL; RoHS: Yes; Category: Chip SMD Resistors; Stock 1: 7298696; Pricing 1: 1=0.10000, 10=0.02300, 100=0.00930, 1000=0.00417, 2500=0.00362 (USD); Contact Plating: Tin,Matte; Case Code (Imperial): 0603; Case Code (Metric): 1608; Size Code: 0603; Min Operating Temperature: -55°C; Max Operating Temperature: 155°C; Temperature Coefficient: 100ppm/°C; Resistor Type: Thick Film; Packaging: Tape and Reel; Termination: SMD/SMT; Features: Moisture Resistant; Series: RC; Max Power Dissipation: 100mW; Number of Terminations: 2; Technology: THICK FILM; Resistance Tolerance: 1%; Construction: Rectangular; Length: 1.6mm; Height: 0.45mm; Depth: 0.8mm; Radiation Hardening: No; REACH SVHC: No SVHC; Lead Free: Lead Free; Military Standard: Not; RoHS Compliant: Yes; Supplier 2: Farnell; Supplier 3: Mouser; Supplier 4: RSComponents; Supplier Part Number 1: 311-1.00KHRCT-ND; Supplier Part Number 2: 2421849; Supplier Part Number 3: 603-RC0603FR-071KL; Supplier Part Number 4: 1995478
R5#2 R6#1 = RES0603_GENERIC: Generic 0603 resistor; Power: *mW; Tolerance: 1%; Manufacturer: Generic
R6#2 R9#1 = RC0402FR-071KL: RES SMD 1K OHM 1% 1/16W 0402; Manufacturer: Yageo; Temperature Coefficient: 100ppm/°C; Voltage Rating (DC): 50V; Power Rating: 62.5mW; Supplier 1: Digi-Key; Manufacturer Part Number: RC0402FR-071KL; RoHS: Yes; Category: Resistors; Stock 1: 37591306; Pricing 1: 1=0.10000, 10=0.01400, 100=0.00580, 1000=0.00262, 2500=0.00228, 5000=0.00188 (USD); Case/Package: 0402; Number of Pins: 2; Case Code (Imperial): 0402; Case Code (Metric): 1005; Min Operating Temperature: -55°C; Max Operating Temperature: 155°C; Resistor Type: Thick Film; Packaging: Tape and Reel; Voltage Rating: 50V; Termination: SMD/SMT; Length: 1mm; Height: 0.32mm; Width: 0.5mm; Depth: 0.5mm; REACH SVHC: Unknown; Lead Free: Lead Free; Military Standard: Not; ComponentLink2URL: https://datasheet.ciiva.com/12666/pyu-rc0402-51-rohs-l-6-r-12666741.pdf; ComponentLink2Description: Online datasheet; Supplier 2: Mouser; Stock 2: 11912978; Pricing 2: 1=0.10000, 10=0.01200, 100=0.00400, 1000=0.00400, 2500=0.00400, 10000=0.00300 (USD); Supplier 3: Farnell; Stock 3: 29900; Pricing 3: 1=0.08130, 25=0.01210, 100=0.01120, 250=0.01030, 500=0.00900 (GBP); Supplier Part Number 3: 2132441; Supplier Part Number 2: 603-RC0402FR-071KL; Supplier Part Number 1: 311-1.00KLRDKR-ND; Created: D.G; Checked: ?
R7#1 R8#1 R13 R14 = RC0402FR-0760K4L: RES SMD 60.4K OHM 1% 1/16W 0402; Manufacturer: Yageo; Temperature Coefficient: 100ppm/°C; Power Rating: 62.5mW; Voltage Rating: 50V; Max Power Dissipation: 63mW; Supplier 1: Digi-Key; Manufacturer Part Number: RC0402FR-0760K4L; RoHS: Yes; Category: Chip SMD Resistors; Stock 1: 412197; Pricing 1: 1=0.10000, 10=0.01600, 100=0.00660, 1000=0.00299, 2500=0.00259, 5000=0.00214 (USD); Case/Package: 0402; Contact Plating: Tin,Matte; Case Code (Imperial): 0402; Case Code (Metric): 1005; Size Code: 0402; Min Operating Temperature: -55°C; Max Operating Temperature: 155°C; Resistor Type: Thick Film; Packaging: Tape and Reel; Termination: SMD/SMT; Voltage Rating (DC): 50V; Features: Moisture Resistant; Series: RC; Number of Terminations: 2; Construction: Rectangular; Length: 1mm; Width: 500um; Depth: 0.5mm; Military Standard: Not; Lead Free: Lead Free; RoHS Compliant: Yes; ComponentLink1URL: https://datasheet.ciiva.com/17068/pyu-rc0402-51-rohs-l-6-r-17068614.pdf; ComponentLink1Description: Online datasheet; Supplier 2: Farnell; Stock 2: 63870; Pricing 2: 10=0.00880, 100=0.00810, 500=0.00740, 2500=0.00510, 5000=0.00420, 10000=0.00360, 50000=0.00240 (GBP); Supplier 3: RSComponents; Stock 3: 19800; Pricing 3: 10000=0.00300 (GBP); Supplier Part Number 3: 1987844; Supplier Part Number 2: 3495651; Supplier Part Number 1: 311-60.4KLRCT-ND
R7#2 = RC0603FR-071ML: Res Thick Film 0603 1M Ohm 1% 0.1W(1/10W) ±100ppm/C Pad SMD T/R; Manufacturer 1: Yageo; Voltage Rating: 50V; Power Rating: 100mW; Temperature Coefficient: 100ppm/°C; Manufacturer Part Number 1: RC0603FR-071ML; RoHS: Yes; Category: Chip SMD Resistors; Mount: Surface Mount; Case Code (Imperial): 0603; Case Code (Metric): 1608; Size Code: 0603; Min Operating Temperature: -55°C; Max Operating Temperature: 155°C; Packaging: Tape and Reel; Package Quantity: 1; Resistor Type: Thick Film; Termination: SMD/SMT; Number of Terminations: 2; Max Power Dissipation: 100mW; Voltage Rating (DC): 50V; Features: Moisture Resistant; Series: RC; Construction: Rectangular; Technology: THICK FILM; Length: 1.6mm; Width: 0.031inch; Height: 0.022inch; Depth: 0.8mm; Military Standard: Not; Lead Free: Lead Free; RoHS Compliant: Yes; ComponentLink5URL: https://datasheet.ciiva.com/2553/pyu-r-int-thick-7-2553533.pdf; ComponentLink5Description: onilne datasheet; Manufacturer: Yageo; Manufacturer Part Number: RC0603FR-071ML; Supplier 1: Digi-Key; Supplier 2: Farnell; Supplier 3: Mouser; Supplier 4: RSComponents; Supplier Part Number 4: 1995481; Supplier Part Number 3: 603-RC0603FR-071ML; Supplier Part Number 2: 9238840; Supplier Part Number 1: 311-1.00MHRCT-ND
R8#2 R9#2 = RES0603_GENERIC: Generic 0603 resistor; Power: *mW; Manufacturer: Generic
R10 = RC0603FR-0739RL: RES SMD 39 OHM 1% 1/10W 0603; Manufacturer: Yageo; Power Rating: 100mW; Voltage Rating: 50V; Temperature Coefficient: 100ppm/°C; Working Voltage: 75V; Manufacturer Part Number: RC0603FR-0739RL; RoHS: Yes; Category: Chip SMD Resistors; Case/Package: 0603; Case Code (Metric): 1608; Min Operating Temperature: -55°C; Max Operating Temperature: 155°C; Packaging: Tape and Reel; Package Quantity: 1; Termination: SMD/SMT; Resistor Type: Thick Film; Number of Terminations: 2; Max Power Dissipation: 100mW; Voltage Rating (DC): 50V; Features: Moisture Resistant; Series: RC; Construction: Rectangular; Technology: THICK FILM; Resistance Tolerance: 1%; Length: 1.6mm; Width: 0.8mm; Height: 0.45mm; Depth: 0.8mm; REACH SVHC: No SVHC; Military Standard: Not; Lead Free: Lead Free; RoHS Compliant: Yes; ComponentLink1URL: https://datasheet.ciiva.com/11819/0900766b80f96399-11819290.pdf; ComponentLink1Description: Online datasheet; Created By: D. Gakure; Tolerance: 1%
R21 R22 = RC0402JR-075K1L: RES SMD 5.1K OHM 5% 1/16W 0402; Manufacturer: Yageo; Voltage Rating: 50V; Power Rating: 62.5mW; Temperature Coefficient: 100ppm/°C; Max Power Dissipation: 63mW; Supplier 1: Digi-Key; Manufacturer Part Number: RC0402JR-075K1L; RoHS: Yes; Category: Chip SMD Resistors; Stock 1: 1270619; Pricing 1: 1=0.10000, 10=0.01300, 100=0.00520, 1000=0.00233, 2500=0.00202, 5000=0.00167 (USD); Case/Package: 0402; Case Code (Metric): 1005; Weight: 2.3E-05oz; Size Code: 0402; Min Operating Temperature: -55°C; Max Operating Temperature: 155°C; Packaging: Tape and Reel; Resistor Type: Thick Film; Termination: SMD/SMT; Voltage Rating (DC): 50V; Features: Moisture Resistant; Series: RC; Number of Terminations: 2; Construction: Rectangular; Resistance Tolerance: 5%; Length: 1mm; Width: 0.5mm; Height: 0.35mm; Depth: 0.5mm; REACH SVHC: No SVHC; Military Standard: Not; Lead Free: Lead Free; RoHS Compliant: Yes; ComponentLink2URL: https://datasheet.ciiva.com/16740/pyu-rc0402-51-rohs-l-6-r-16740925.pdf; ComponentLink2Description: Onnline datasheet; Supplier 2: Newark; Stock 2: 1265; Pricing 2: 1=0.10000, 25=0.01000, 100=0.00400, 250=0.00400, 500=0.00300, 1000=0.00300 (USD); Supplier 3: Mouser; Stock 3: 100817; Pricing 3: 1=0.10000, 10=0.01000, 50=0.01000, 100=0.00400, 1000=0.00300, 10000=0.00200 (USD); Supplier 4: Farnell; Stock 4: 68890; Pricing 4: 10=0.00910, 100=0.00390, 500=0.00320, 2500=0.00240, 5000=0.00210, 10000=0.00190, 50000=0.00150 (GBP); Supplier 5: Farnell; Stock 5: 1265; Pricing 5: 10000=0.00270 (GBP); Supplier Part Number 5: 1799293; Supplier Part Number 4: 3495714; Supplier Part Number 3: 603-RC0402JR-075K1L; Supplier Part Number 2: 68R0016; Supplier Part Number 1: 311-5.1KJRCT-ND; Created By: D. Gakure; Checked By: ?
R29 = RC0402FR-0722KL: RES SMD 22K OHM 1% 1/16W 0402; Manufacturer: Yageo; Temperature Coefficient: 100ppm/°C; Power Rating: 63mW; Voltage Rating: 50V; Manufacturer Part Number: RC0402FR-0722KL; RoHS: Yes; Category: Resistors; Case Code (Metric): 1005; Case Code (Imperial): 0402; Min Operating Temperature: -55°C; Max Operating Temperature: 155°C; Resistor Type: Thick Film; Packaging: Tape and Reel; Package Quantity: 1; Number of Terminations: 2; Termination: SMD/SMT; Max Power Dissipation: 63mW; Working Voltage: 50V; Features: Moisture Resistant; Length: 0.039inch; Height: 0.016inch; Width: 0.02inch; Depth: 0.5mm; REACH SVHC: No SVHC; Lead Free: Lead Free; Military Standard: Not; ComponentLink2URL: https://datasheet.ciiva.com/2453/pyu-r-int-thick-7-2453361.pdf; ComponentLink2Description: Online datasheet; Created By: DG; Checked By: ?; Tolerance: 1%; Case/Package: 0402
R30 = RC0402FR-07330KL: RES SMD 330K OHM 1% 1/16W 0402; Manufacturer: Yageo; Power Rating: 63mW; Voltage Rating: 50V; Temperature Coefficient: 100ppm/°C; Supplier 1: Digi-Key; Manufacturer Part Number: RC0402FR-07330KL; RoHS: Yes; Category: Chip SMD Resistors; Stock 1: 78809; Pricing 1: 1=0.10000, 10=0.01600, 100=0.00660, 1000=0.00299, 2500=0.00259, 5000=0.00214 (USD); Case/Package: 0402; Case Code (Metric): 1005; Case Code (Imperial): 0402; Min Operating Temperature: -55°C; Max Operating Temperature: 155°C; Package Quantity: 1; Packaging: Tape and Reel; Resistor Type: Thick Film; Number of Terminations: 2; Termination: SMD/SMT; Max Power Dissipation: 63mW; Features: Moisture Resistant; Series: RC; Resistance Tolerance: 1%; Construction: Rectangular; Length: 1mm; Width: 0.02inch; Height: 0.016inch; Depth: 0.5mm; REACH SVHC: Unknown; Military Standard: Not; Lead Free: Lead Free; RoHS Compliant: Yes; ComponentLink1URL: https://datasheet.ciiva.com/2518/pyu-r-int-thick-7-2518994.pdf?src-supplier=Digi-Key; ComponentLink1Description: Online datasheet; Supplier 2: Mouser; Stock 2: 218637; Pricing 2: 1=0.10000, 10=0.01400, 50=0.01400, 100=0.00500, 1000=0.00300, 10000=0.00200 (USD); Supplier 3: Farnell; Stock 3: 310234; Pricing 3: 10=0.01210, 100=0.00460, 500=0.00410, 2500=0.00310, 5000=0.00280, 10000=0.00250, 50000=0.00180 (GBP); Supplier Part Number 2: 603-RC0402FR-07330KL; Supplier Part Number 1: 311-330KLRCT-ND; Supplier Part Number 3: 9239537; Created By: D Gakure; Checked By: ?; Tolerance: 1%; Size Code: 0402
U1 = NCP114BSN330T1G: CMOS Low Dropout Regulator (LDO), 300 mA 3.3V, Non-Active Discharge, TSOP5; Manufacturer: ON Semiconductor; Polarity: Positive; Quiescent Current: 50uA; Max Input Voltage: 5.5V; Min Input Voltage: 1.7V; Max Output Current: 300mA; Number of Outputs: 1; Accuracy: 2%; Output Type: Fixed; Supplier 1: Digi-Key; RoHS: Yes; Category: Voltage Regulators - Linear; Stock 1: 4067; Pricing 1: 1=0.45000, 10=0.33700, 25=0.29440, 100=0.19060, 250=0.15780, 500=0.12624, 1000=0.09679 (USD); Mount: Surface Mount; Case/Package: TSOP; Number of Pins: 5; Min Operating Temperature: -40°C; Max Operating Temperature: 85°C; Output Voltage: 3.3V; Lead Free: Lead Free; RoHS Compliant: Yes; ComponentLink1URL: http://www.farnell.com/datasheets/2118270.pdf?src-supplier=Farnell; ComponentLink1Description: Datasheet (online); Supplier 2: Mouser; Supplier 3: RSComponents; Supplier Part Number 2: 863-NCP114BSN330T1G; Supplier Part Number 3: 1263179; Supplier Part Number 1: NCP114BSN330T1GOSCT-ND; Manufacturer Part Number: NCP114BSN330T1G
U2#1 U3#1 = PMS150C: 8bit OTP Type IO Controller; Manufacturer: PADAUK; ComponentLink1Description: Padauk datasheet online; ComponentLink1URL: http://www.padauk.com.tw/upload/doc/PMS15A,PMS150C%20datasheet%20V108_EN_20200724.pdf; Supplier 1: LCSC; Supplier Part Number 1: C168658; Package: SOT-23-6; Pricing 1: 1=0.6, 10=0.0595, 100=0.0449; Stock 1: 0; Supplier Order Qty 1: 3000
U2#2 U10 U11 = TPS2553DBVR: IC PWR SWITCH N-CHAN 1:1 SOT23-6; Manufacturer: Texas Instruments; Number of Outputs: 1; Min Supply Voltage: 2.5V; Max Supply Voltage: 6.5V; On-State Resistance: 85mR; Output Current: 1.5A; Max Power Dissipation: 625mW; Supplier 1: Digi-Key; RoHS: Yes; Category: Hot Swap Controllers; Stock 1: 14713; Pricing 1: 1=1.20000, 10=1.07100, 25=1.01640, 100=0.78050, 250=0.68972, 500=0.65340, 1000=0.50820 (USD); Case/Package: SOT-23; Number of Pins: 6; Weight: 0.00127oz; Min Operating Temperature: -40°C; Max Operating Temperature: 85°C; Packaging: Tape and Reel; Package Quantity: 1; Max Input Voltage: 6.5V; Min Input Voltage: 2.5V; Radiation Hardening: No; Lead Free: Lead Free; REACH SVHC: No SVHC; ComponentLink1URL: https://datasheet.ciiva.com/15108/getdatasheetpartid-297517-15108509.pdf; ComponentLink1Description: Online datasheet; Supplier 2: Farnell; Supplier 3: Mouser; Supplier Part Number 3: 595-TPS2553DBVR; Supplier Part Number 2: 3124082; Supplier Part Number 1: 296-32464-1-ND; Manufacturer Part Number: TPS2553DBVR
U3#2 = PFS122-SO8: 8bit MTP MCU with 12-bit ADC; Manufacturer: PADAUK; ComponentLink1Description: Online datasheet; ComponentLink1URL: http://www.padauk.com.tw/upload/doc/PFS122%20datasheet_EN_V001_20220518.pdf; Package: SOP-8; Manufacturer Part Number: PFS122-S08
U6 U7 = 74LVC1G66GW,125: Analog Switch Single SPST 5-Pin TSSOP T/R; Manufacturer: Nexperia; Supplier 1: Digi-Key; RoHS: Yes; Category: Decoders and Multiplexers; Pricing 1: 1=0.41000, 10=0.34000, 25=0.28440, 100=0.18010, 250=0.13900, 500=0.11846, 1000=0.08055 (USD); ComponentLink1URL: https://www.mouser.com/ds/2/302/74LVC1G66-1151275.pdf?src-supplier=Mouser; ComponentLink1Description: Online datasheet; Supplier 2: Newark; Stock 2: 1; Pricing 2: 5=0.35500, 10=0.28900, 25=0.24200, 50=0.19900, 100=0.15500, 250=0.12200 (USD); Supplier 3: RSComponents; Stock 3: 1; Pricing 3: 50=0.28600, 100=0.11900, 250=0.11500, 500=0.10800, 1000=0.10000 (USD); Supplier 4: Mouser; Stock 4: 3; Pricing 4: 1=0.36000, 10=0.28400, 50=0.28400, 100=0.13700, 1000=0.07600, 10000=0.06500 (USD); Supplier Part Number 4: 771-74LVC1G66GW-G; Supplier Part Number 3: 0510386; Supplier Part Number 2: 03P2780; Supplier Part Number 1: 1727-4118-6-ND; Manufacturer Part Number: 74LVC1G66GW,125

## Assembly variants
JLCPCB: alternate parts R7 -> 0402WGF6042TCE, R8 -> 0402WGF6042TCE, R13 -> 0402WGF6042TCE, R14 -> 0402WGF6042TCE, R16 -> 0402WGF6042TCE, R17 -> 0402WGF6042TCE, R19 -> 0402WGF6042TCE, R20 -> 0402WGF6042TCE, D14 -> RB161MM-20TR, D18 -> RB161MM-20TR, D20 -> RB161MM-20TR, D21 -> RB161MM-20TR